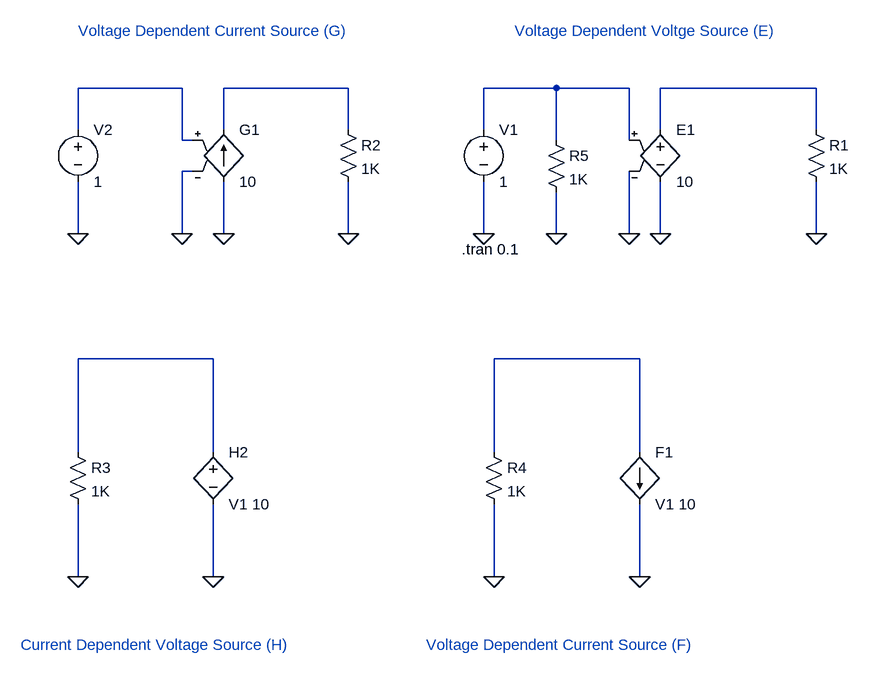
[diagram p0: schematic 8. Dependent Sources.asc]
8. Dependent Sources.asc, the LTspice schematic file:
Version 4
SHEET 1 880 904
WIRE -640 32 -800 32
WIRE -384 32 -576 32
WIRE -64 32 -176 32
WIRE 48 32 -64 32
WIRE 336 32 96 32
WIRE -800 96 -800 32
WIRE -576 96 -576 32
WIRE -384 96 -384 32
WIRE -176 96 -176 32
WIRE 96 96 96 32
WIRE 336 96 336 32
WIRE -640 112 -640 32
WIRE -624 112 -640 112
WIRE -64 112 -64 32
WIRE 48 112 48 32
WIRE -624 160 -640 160
WIRE -800 256 -800 176
WIRE -640 256 -640 160
WIRE -576 256 -576 176
WIRE -384 256 -384 176
WIRE -176 256 -176 176
WIRE -64 256 -64 192
WIRE 48 256 48 160
WIRE 96 256 96 176
WIRE 336 256 336 176
WIRE -592 448 -800 448
WIRE 64 448 -160 448
WIRE -800 592 -800 448
WIRE -592 592 -592 448
WIRE -160 592 -160 448
WIRE 64 592 64 448
WIRE -800 784 -800 672
WIRE -592 784 -592 672
WIRE -160 784 -160 672
WIRE 64 784 64 672
FLAG -176 256 0
FLAG 48 256 0
FLAG 96 256 0
FLAG 336 256 0
FLAG -800 256 0
FLAG -640 256 0
FLAG -576 256 0
FLAG -384 256 0
FLAG 64 784 0
FLAG -160 784 0
FLAG -592 784 0
FLAG -800 784 0
FLAG -64 256 0
SYMBOL e 96 80 R0
SYMATTR InstName E1
SYMATTR Value 10
SYMBOL voltage -176 80 R0
WINDOW 123 0 0 Left 0
WINDOW 39 0 0 Left 0
SYMATTR InstName V1
SYMATTR Value 1
SYMBOL res 320 80 R0
SYMATTR InstName R1
SYMATTR Value 1K
SYMBOL g -576 80 R0
SYMATTR InstName G1
SYMATTR Value 10
SYMBOL voltage -800 80 R0
WINDOW 123 0 0 Left 0
WINDOW 39 0 0 Left 0
SYMATTR InstName V2
SYMATTR Value 1
SYMBOL res -400 80 R0
SYMATTR InstName R2
SYMATTR Value 1K
SYMBOL h -592 576 R0
SYMATTR InstName H2
SYMATTR Value V1 10
SYMBOL f 64 592 R0
SYMATTR InstName F1
SYMATTR Value V1 10
SYMBOL res -816 576 R0
SYMATTR InstName R3
SYMATTR Value 1K
SYMBOL res -176 576 R0
SYMATTR InstName R4
SYMATTR Value 1K
SYMBOL res -80 96 R0
SYMATTR InstName R5
SYMATTR Value 1K
TEXT -210 280 Left 2 !.tran 0.1
TEXT -128 -56 Left 2 ;Voltage Dependent Voltge Source (E)
TEXT -800 -56 Left 2 ;Voltage Dependent Current Source (G)
TEXT -264 888 Left 2 ;Voltage Dependent Current Source (F)
TEXT -888 888 Left 2 ;Current Dependent Voltage Source (H)

The netlist it stands for:
* 8. Dependent Sources.asc
E1 N004 0 N003 0 10
V1 N003 0 1
R1 N004 0 1K
G1 0 N002 N001 0 10
V2 N001 0 1
R2 N002 0 1K
H2 N005 0 V1 10
F1 N006 0 V1 10
R3 N005 0 1K
R4 N006 0 1K
R5 N003 0 1K
.tran 0.1
* Voltage Dependent Voltge Source (E)
* Voltage Dependent Current Source (G)
* Voltage Dependent Current Source (F)
* Current Dependent Voltage Source (H)
.backanno
.end